# EAGLE design 16ChFNIRS (EAGLE 9.6.2)
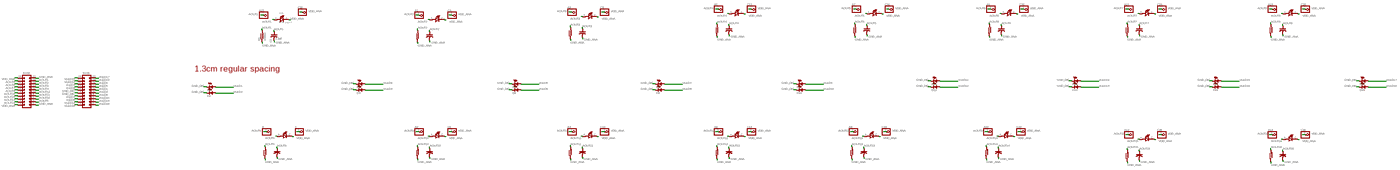
[diagram p0: schematic, sheet 1, overview]
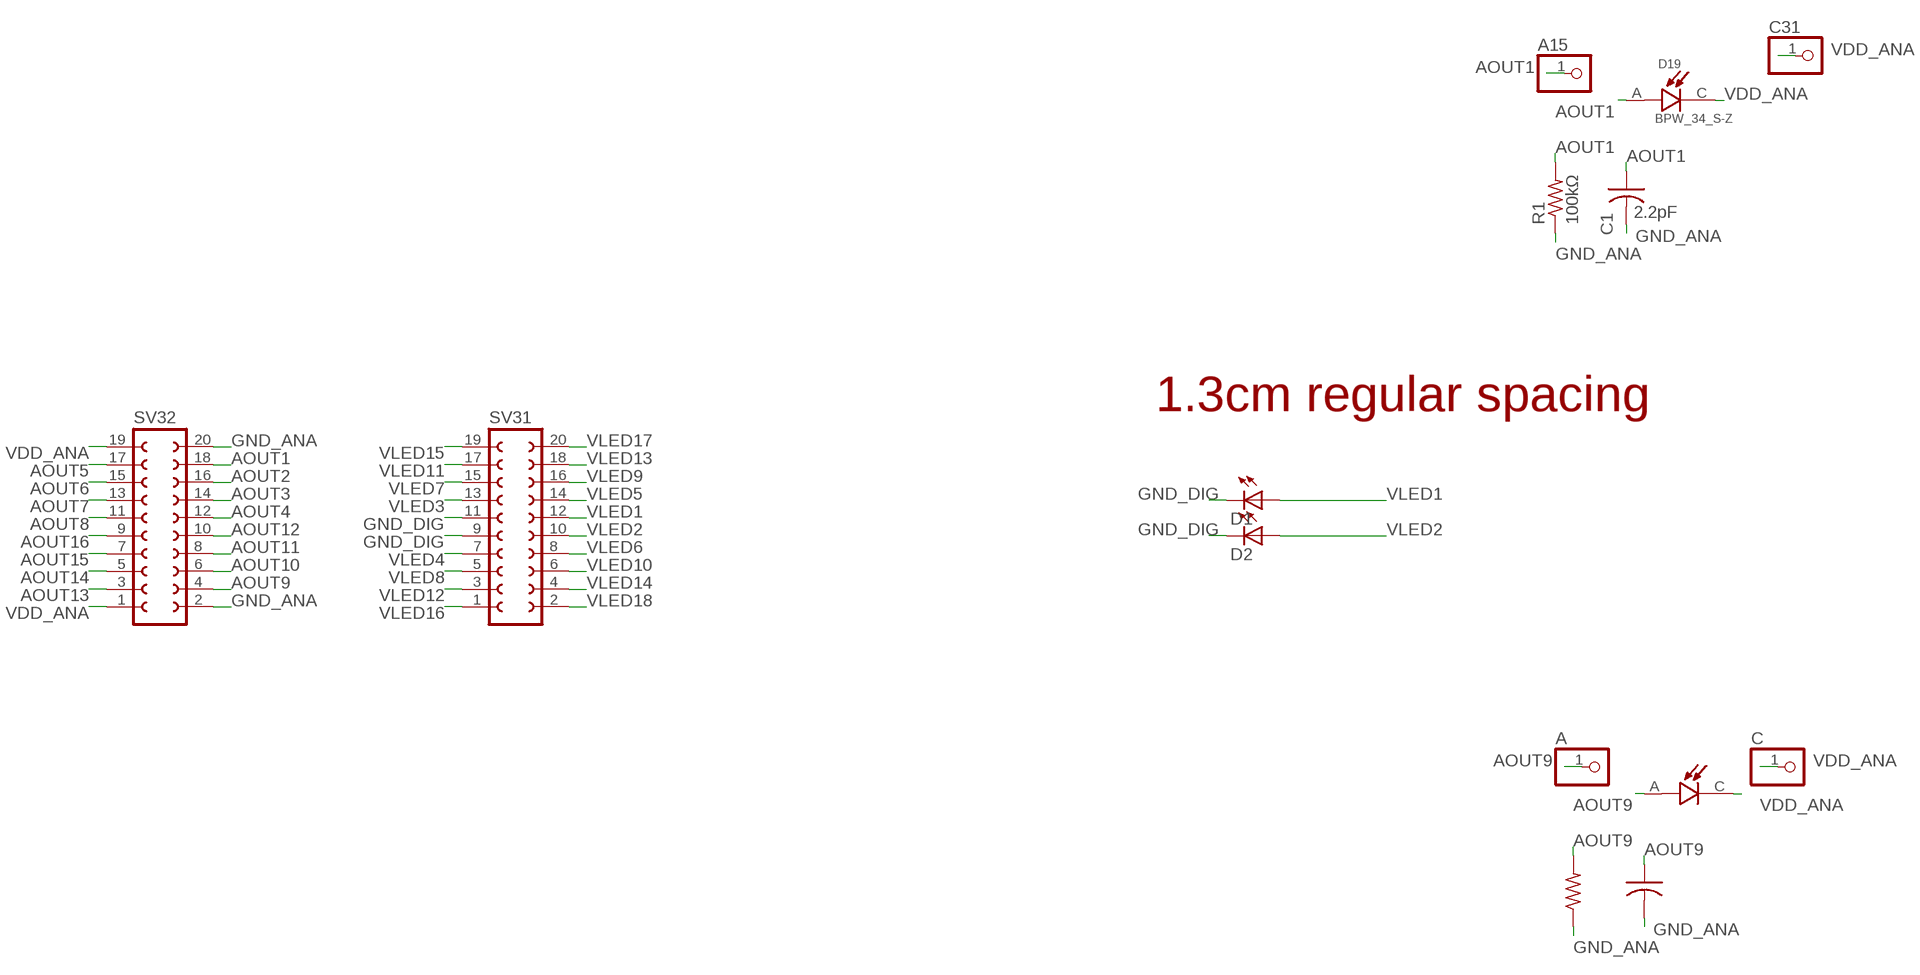
[diagram p1: schematic, sheet 1, part 1 of 4]
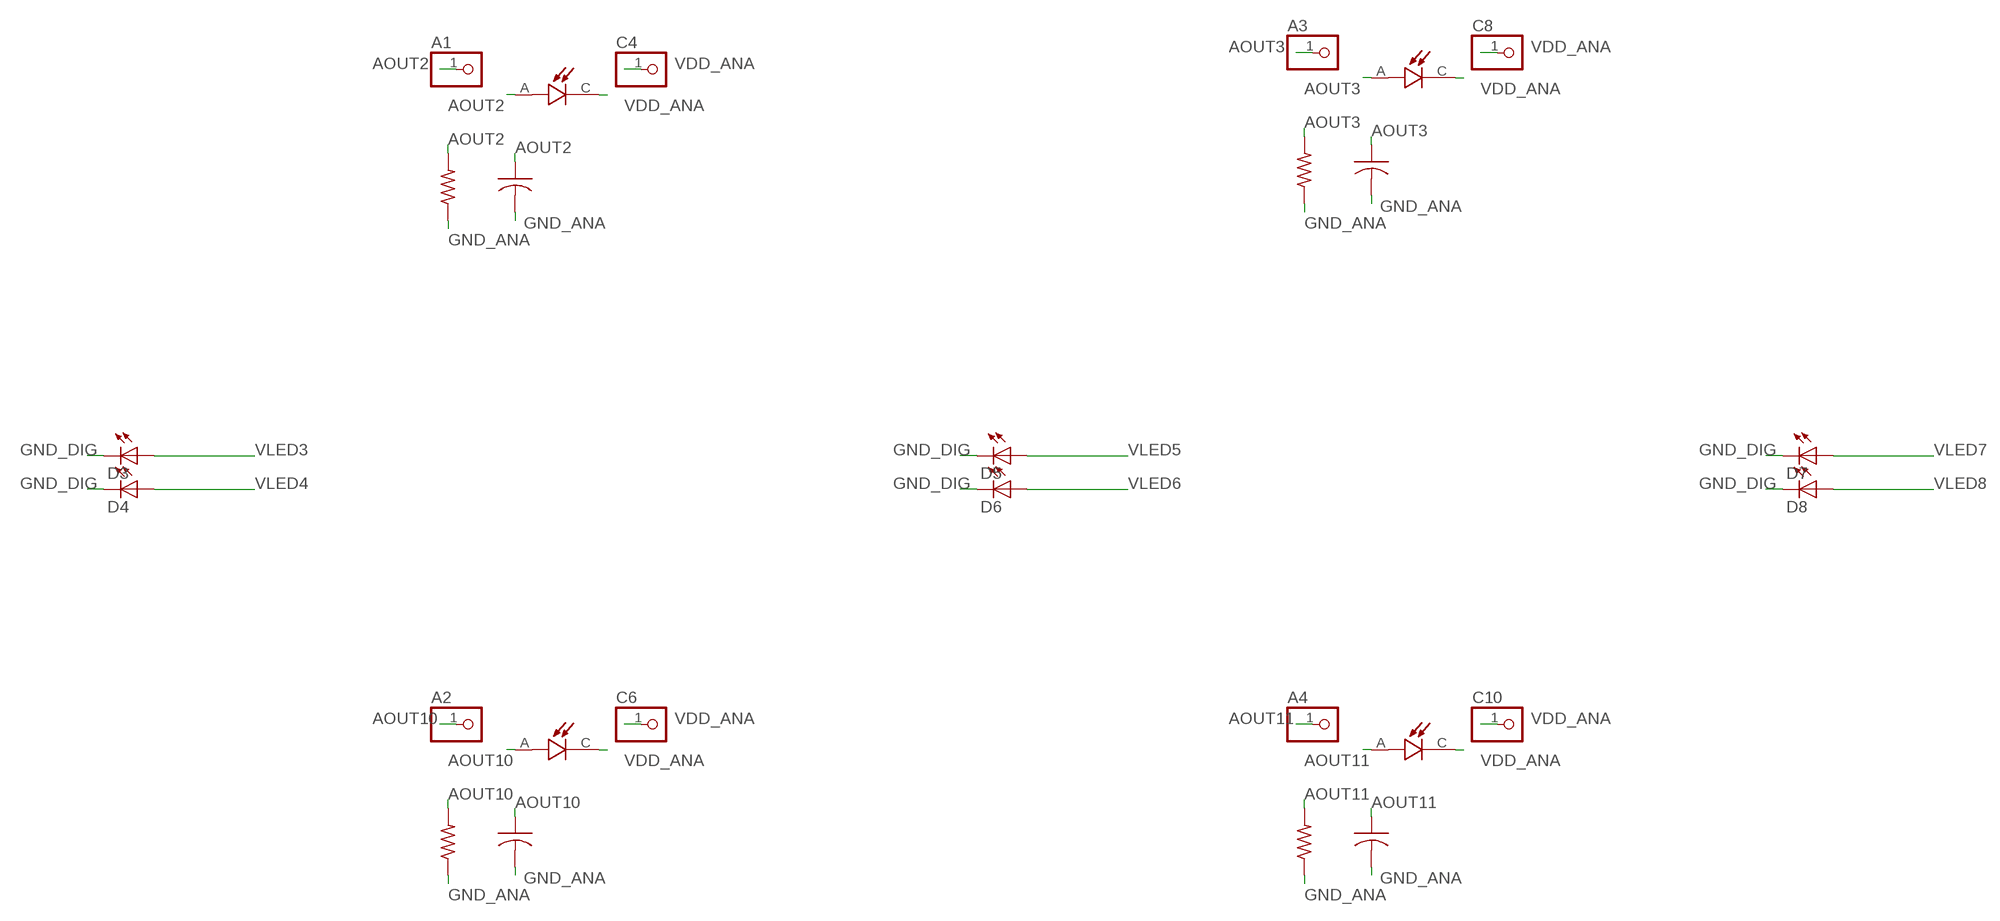
[diagram p2: schematic, sheet 1, part 2 of 4]
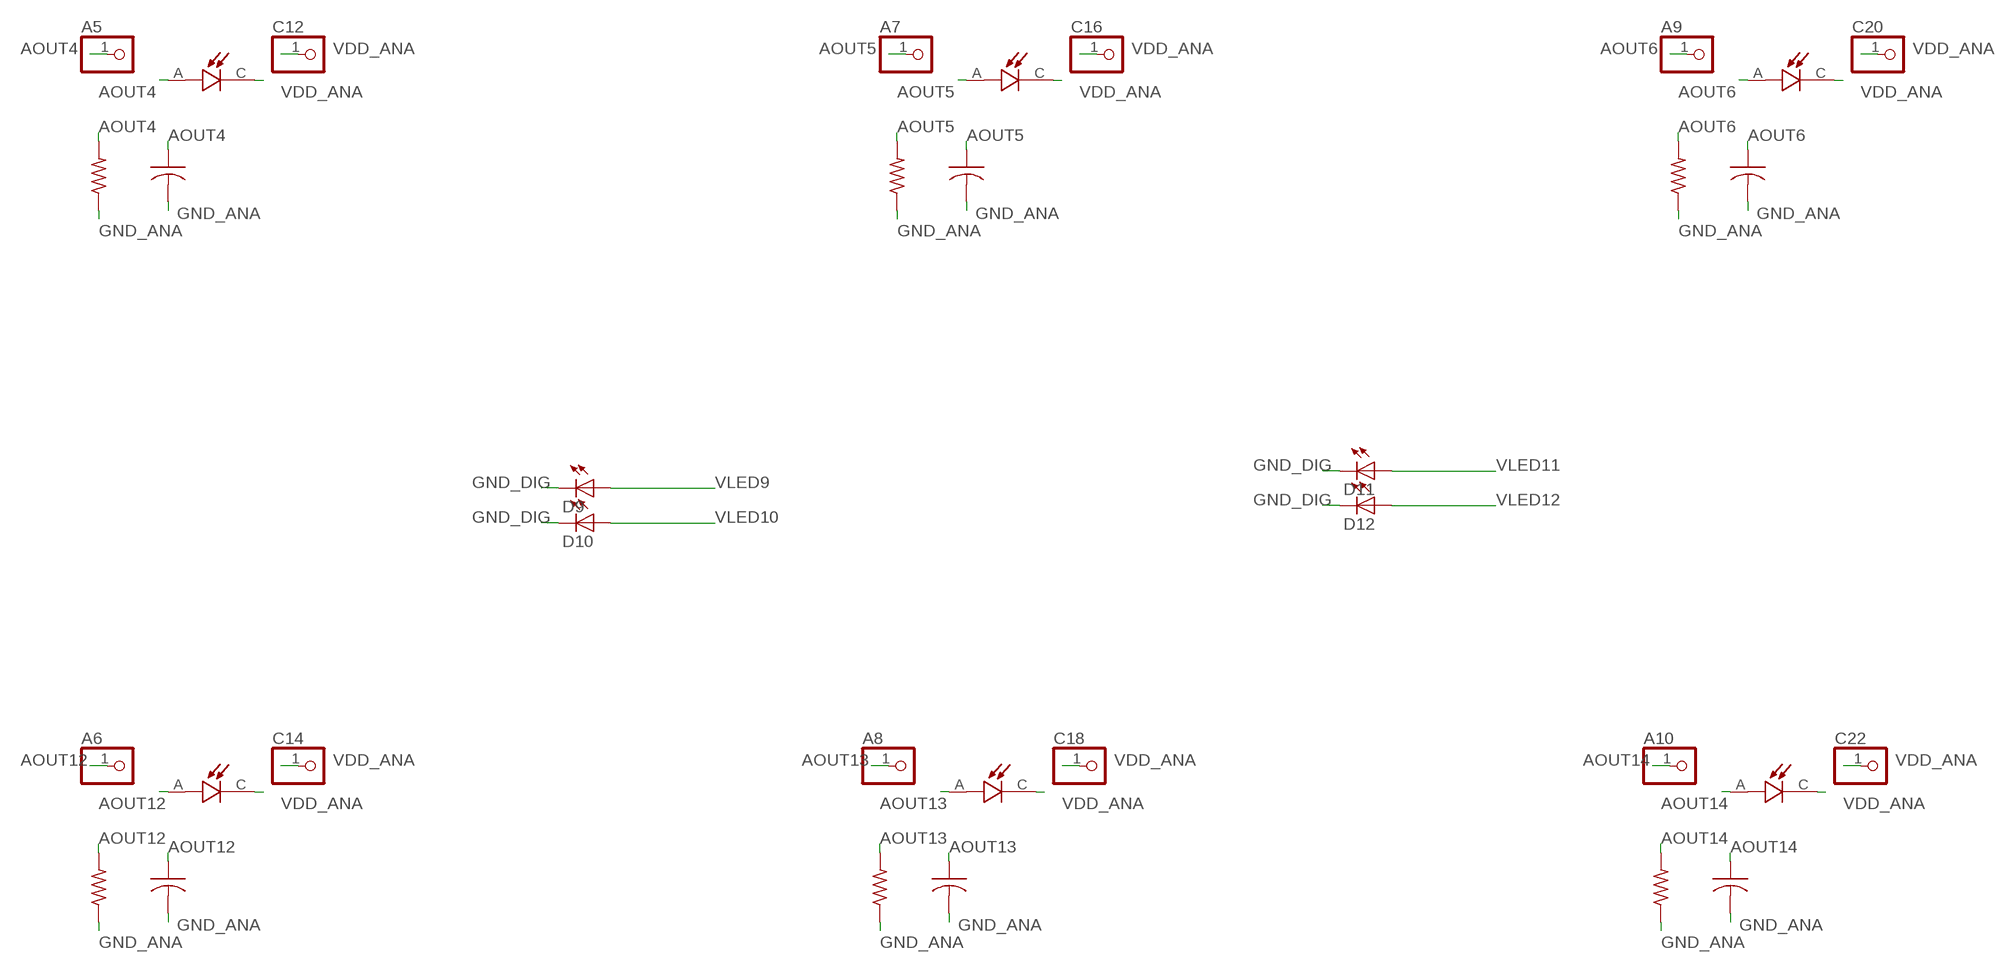
[diagram p3: schematic, sheet 1, part 3 of 4]
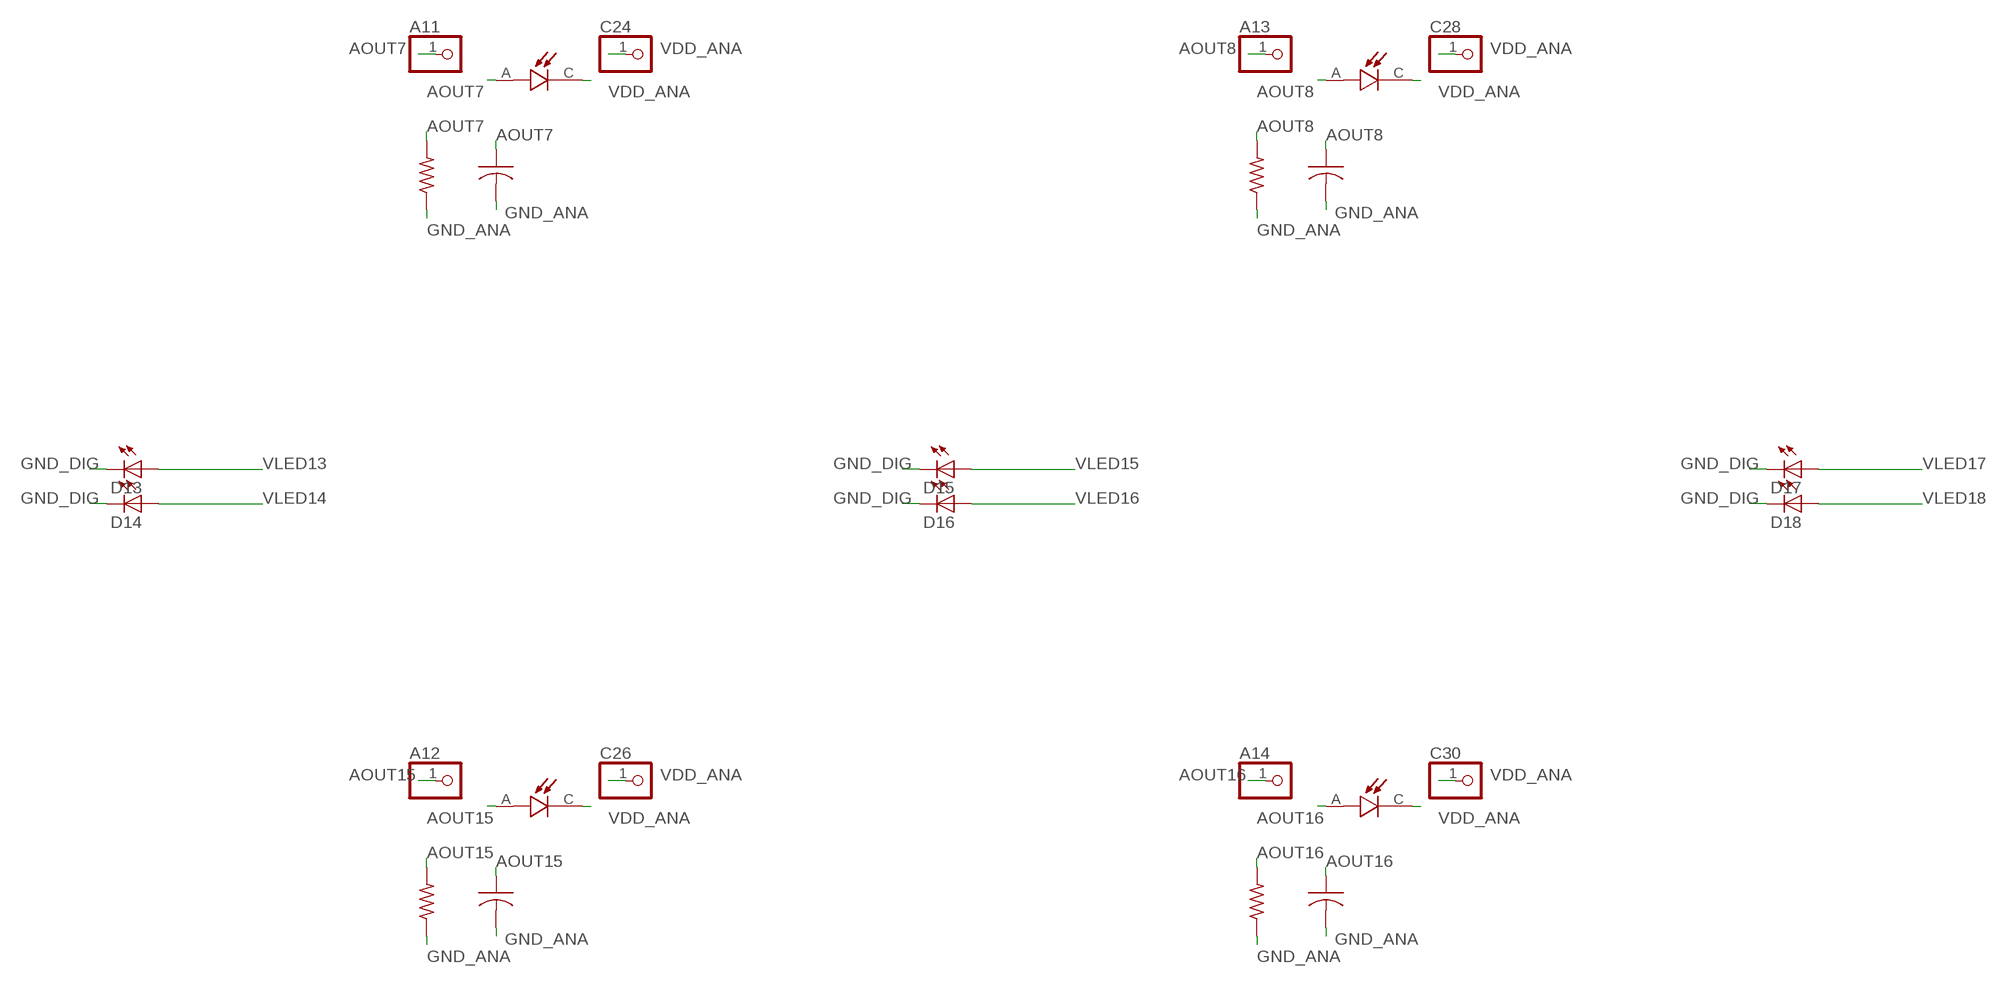
[diagram p4: schematic, sheet 1, part 4 of 4]

## Parts
A  PINHD-1X1  [1X01]
A1  PINHD-1X1  [1X01]
A2  PINHD-1X1  [1X01]
A3  PINHD-1X1  [1X01]
A4  PINHD-1X1  [1X01]
A5  PINHD-1X1  [1X01]
A6  PINHD-1X1  [1X01]
A7  PINHD-1X1  [1X01]
A8  PINHD-1X1  [1X01]
A9  PINHD-1X1  [1X01]
A10  PINHD-1X1  [1X01]
A11  PINHD-1X1  [1X01]
A12  PINHD-1X1  [1X01]
A13  PINHD-1X1  [1X01]
A14  PINHD-1X1  [1X01]
A15  PINHD-1X1  [1X01]
C  PINHD-1X1  [1X01]
C1  2.2pF  C-US025-024X044  [C025-024X044]
C2  2.2pF  C-US025-024X044  [C025-024X044]
C3  2.2pF  C-US025-024X044  [C025-024X044]
C4  PINHD-1X1  [1X01]
C5  2.2pF  C-US025-024X044  [C025-024X044]
C6  PINHD-1X1  [1X01]
C7  2.2pF  C-US025-024X044  [C025-024X044]
C8  PINHD-1X1  [1X01]
C9  2.2pF  C-US025-024X044  [C025-024X044]
C10  PINHD-1X1  [1X01]
C11  2.2pF  C-US025-024X044  [C025-024X044]
C12  PINHD-1X1  [1X01]
C13  2.2pF  C-US025-024X044  [C025-024X044]
C14  PINHD-1X1  [1X01]
C15  2.2pF  C-US025-024X044  [C025-024X044]
C16  PINHD-1X1  [1X01]
C17  2.2pF  C-US025-024X044  [C025-024X044]
C18  PINHD-1X1  [1X01]
C19  2.2pF  C-US025-024X044  [C025-024X044]
C20  PINHD-1X1  [1X01]
C21  2.2pF  C-US025-024X044  [C025-024X044]
C22  PINHD-1X1  [1X01]
C23  2.2pF  C-US025-024X044  [C025-024X044]
C24  PINHD-1X1  [1X01]
C25  2.2pF  C-US025-024X044  [C025-024X044]
C26  PINHD-1X1  [1X01]
C27  2.2pF  C-US025-024X044  [C025-024X044]
C28  PINHD-1X1  [1X01]
C29  2.2pF  C-US025-024X044  [C025-024X044]
C30  PINHD-1X1  [1X01]
C31  PINHD-1X1  [1X01]
D1  LED1206  [LED-1206]
D2  LED1206  [LED-1206]
D3  LED1206  [LED-1206]
D4  LED1206  [LED-1206]
D5  LED1206  [LED-1206]
D6  LED1206  [LED-1206]
D7  LED1206  [LED-1206]
D8  LED1206  [LED-1206]
D9  LED1206  [LED-1206]
D10  LED1206  [LED-1206]
D11  LED1206  [LED-1206]
D12  LED1206  [LED-1206]
D13  LED1206  [LED-1206]
D14  LED1206  [LED-1206]
D15  LED1206  [LED-1206]
D16  LED1206  [LED-1206]
D17  LED1206  [LED-1206]
D18  LED1206  [LED-1206]
D19  BPW_34_S-Z  [DIO_BPW_34_S-Z]
D20  BPW_34_S-Z  [DIO_BPW_34_S-Z]
D21  BPW_34_S-Z  [DIO_BPW_34_S-Z]
D22  BPW_34_S-Z  [DIO_BPW_34_S-Z]
D23  BPW_34_S-Z  [DIO_BPW_34_S-Z]
D24  BPW_34_S-Z  [DIO_BPW_34_S-Z]
D25  BPW_34_S-Z  [DIO_BPW_34_S-Z]
D26  BPW_34_S-Z  [DIO_BPW_34_S-Z]
D27  BPW_34_S-Z  [DIO_BPW_34_S-Z]
D28  BPW_34_S-Z  [DIO_BPW_34_S-Z]
D29  BPW_34_S-Z  [DIO_BPW_34_S-Z]
D30  BPW_34_S-Z  [DIO_BPW_34_S-Z]
D31  BPW_34_S-Z  [DIO_BPW_34_S-Z]
D32  BPW_34_S-Z  [DIO_BPW_34_S-Z]
D33  BPW_34_S-Z  [DIO_BPW_34_S-Z]
D34  BPW_34_S-Z  [DIO_BPW_34_S-Z]
R1  100kΩ  R-US_0204/5  [0204/5]
R2  100kΩ  R-US_0204/5  [0204/5]
R3  100kΩ  R-US_0204/5  [0204/5]
R4  100kΩ  R-US_0204/5  [0204/5]
R5  100kΩ  R-US_0204/5  [0204/5]
R6  100kΩ  R-US_0204/5  [0204/5]
R7  100kΩ  R-US_0204/5  [0204/5]
R8  100kΩ  R-US_0204/5  [0204/5]
R9  100kΩ  R-US_0204/5  [0204/5]
R10  100kΩ  R-US_0204/5  [0204/5]
R11  100kΩ  R-US_0204/5  [0204/5]
R12  100kΩ  R-US_0204/5  [0204/5]
R13  100kΩ  R-US_0204/5  [0204/5]
R14  100kΩ  R-US_0204/5  [0204/5]
R15  100kΩ  R-US_0204/5  [0204/5]
R16  100kΩ  R-US_0204/5  [0204/5]
SV31  FE10-2  [FE10-2]
SV32  FE10-2  [FE10-2]

## Nets
AOUT1: A15.1 C1.1 D19.A R1.2 SV32.18
AOUT2: A1.1 C3.1 D21.A R3.2 SV32.16
AOUT3: A3.1 C7.1 D23.A R5.2 SV32.14
AOUT4: A5.1 C11.1 D25.A R7.2 SV32.12
AOUT5: A7.1 C15.1 D27.A R9.2 SV32.17
AOUT6: A9.1 C19.1 D29.A R11.2 SV32.15
AOUT7: A11.1 C23.1 D31.A R13.2 SV32.13
AOUT8: A13.1 C27.1 D33.A R15.2 SV32.11
AOUT9: A.1 C2.1 D20.A R2.2 SV32.4
AOUT10: A2.1 C5.1 D22.A R4.2 SV32.6
AOUT11: A4.1 C9.1 D24.A R6.2 SV32.8
AOUT12: A6.1 C13.1 D26.A R8.2 SV32.10
AOUT13: A8.1 C17.1 D28.A R10.2 SV32.3
AOUT14: A10.1 C21.1 D30.A R12.2 SV32.5
AOUT15: A12.1 C25.1 D32.A R14.2 SV32.7
AOUT16: A14.1 C29.1 D34.A R16.2 SV32.9
GND_ANA: C1.2 C2.2 C3.2 C5.2 C7.2 C9.2 C11.2 C13.2 C15.2 C17.2 C19.2 C21.2 C23.2 C25.2 C27.2 C29.2 R1.1 R2.1 R3.1 R4.1 R5.1 R6.1 R7.1 R8.1 R9.1 R10.1 R11.1 R12.1 R13.1 R14.1 R15.1 R16.1 SV32.2 SV32.20
GND_DIG: D1.C D2.C D3.C D4.C D5.C D6.C D7.C D8.C D9.C D10.C D11.C D12.C D13.C D14.C D15.C D16.C D17.C D18.C SV31.9 SV31.11
VDD_ANA: C4.1 C6.1 C8.1 C10.1 C12.1 C14.1 C16.1 C18.1 C20.1 C22.1 C24.1 C26.1 C28.1 C30.1 C31.1 C.1 D19.C D20.C D21.C D22.C D23.C D24.C D25.C D26.C D27.C D28.C D29.C D30.C D31.C D32.C D33.C D34.C SV32.1 SV32.19
VLED1: D1.A SV31.12
VLED2: D2.A SV31.10
VLED3: D3.A SV31.13
VLED4: D4.A SV31.7
VLED5: D5.A SV31.14
VLED6: D6.A SV31.8
VLED7: D7.A SV31.15
VLED8: D8.A SV31.5
VLED9: D9.A SV31.16
VLED10: D10.A SV31.6
VLED11: D11.A SV31.17
VLED12: D12.A SV31.3
VLED13: D13.A SV31.18
VLED14: D14.A SV31.4
VLED15: D15.A SV31.19
VLED16: D16.A SV31.1
VLED17: D17.A SV31.20
VLED18: D18.A SV31.2

## Notes on the sheet
- 1.3cm regular spacing

## Library data of the parts
A A1-A15 C C4 C6 C8 C10 C12 C14 C16 C18 C20 C22 C24 C26 C28 C30 C31 = adafruit:PINHD-1X1: Pin header 1x1 for 0.1" spacing With round pins
C1-C3 C5 C7 C9 C11 C13 C15 C17 C19 C21 C23 C25 C27 C29 = adafruit:C-US: CAPACITOR, American symbol
D1-D18 = epic:LED: LEDs Standard schematic elements and footprints for 5mm, 3mm, 1206, and 0603 sized LEDs. 5mm - Spark Fun Electronics SKU : COM-00529 (and others)
D19-D34 = BPW_34_S-Z:BPW_34_S-Z: Silicon PIN Photodiode Check availability <https://pricing.snapeda.com/parts/BPW%2034%20S-Z/OSRAM%20Opto/view-part?ref=eda>; AVAILABILITY: In Stock; DESCRIPTION: Photodiode 850nm 20ns 120° 2-SMD, Gull Wing; MF: OSRAM Opto; MP: BPW 34 S-Z; PACKAGE: SMD-2 OSRAM Opto Semiconductors; PRICE: None; PURCHASE-URL: https://pricing.snapeda.com/search/part/BPW 34 S-Z/?ref=eda
R1-R16 = adafruit:R-US_: RESISTOR, American symbol
SV31 SV32 = con-lsta:FE10-2: FEMALE HEADER; OC_FARNELL: unknown; OC_NEWARK: unknown

## Board
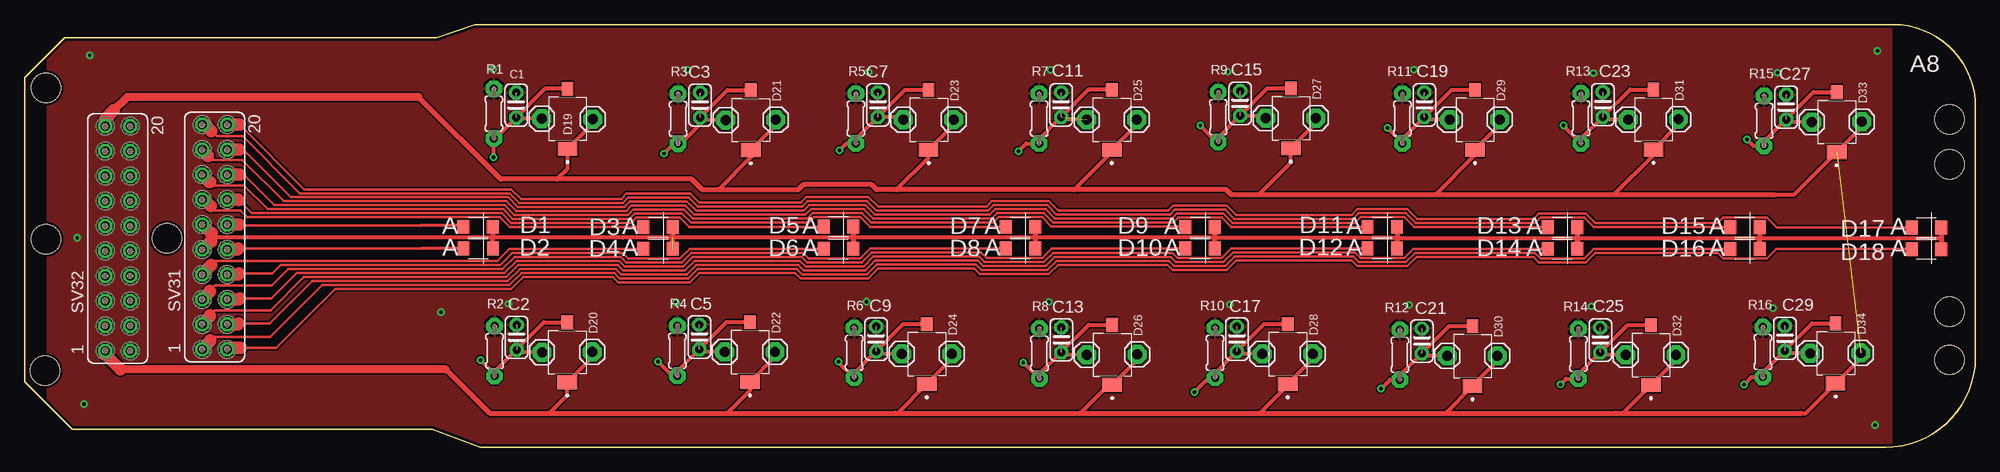
[diagram p5: board, top side]
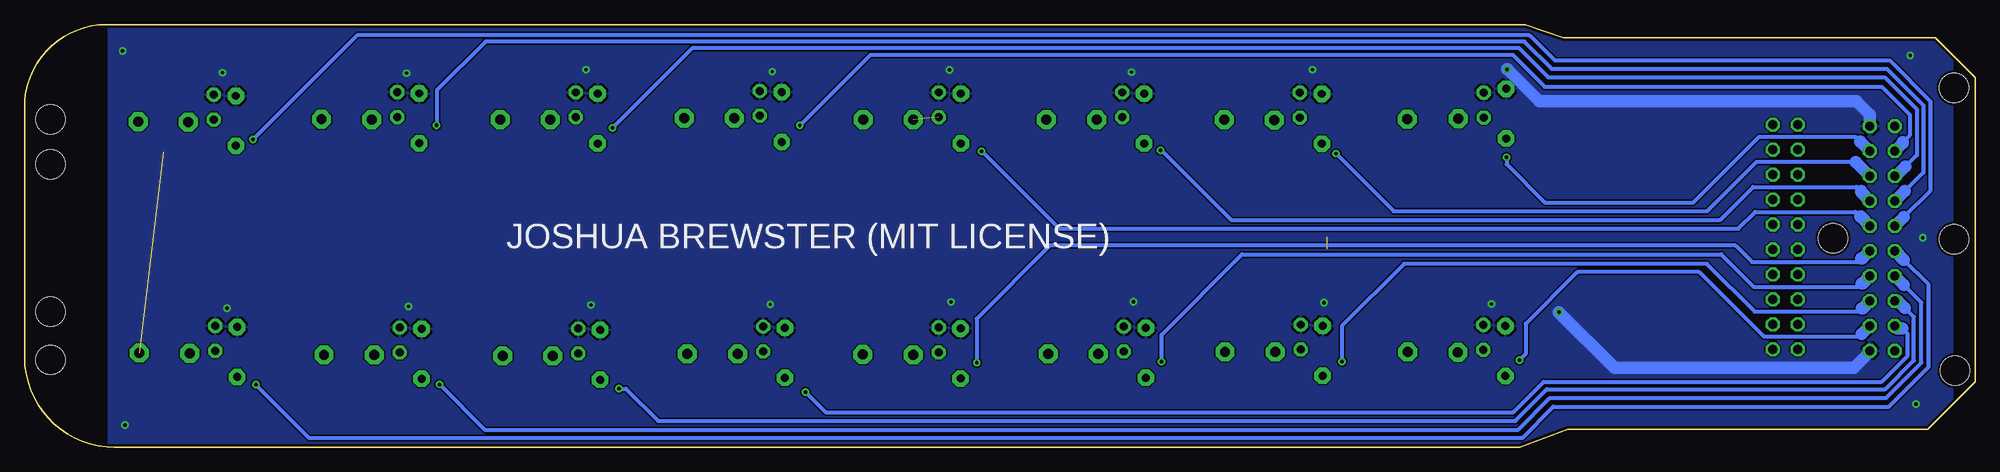
[diagram p6: board, bottom side, seen from below]

Size 198.42 x 43.03 mm. Coordinates in mm from the lower left corner, seen from the top.
Outline: 41.91,41.71 4.06,41.71 0,37.64 0,6.65 4.83,1.83 41.45,1.83 46.33,0 189.28,0 arc90 198.43,9.14 198.43,34.65 arc90 190.04,43.03 45.77,43.03 41.91,41.71
Copper layers (1*16): Top 0.035mm / dielectric 1.5mm / Bottom 0.035mm
Design rules "default *": minimum track width 6mil, minimum drill 0.35mm, track to track 6mil, track to pad 6mil, pad to pad 6mil, via to via 6mil, smd to smd 6mil, copper to edge 10mil, drill to drill 6mil, minimum pad ring 10mil, minimum via ring 8mil, stop-mask expansion 4mil, vias tented up to drill 0mil, thermal gap 10mil
Holes 3 mm at 2.17,36.58 14.47,21.28 2.17,21.18 2.07,7.78 195.77,33.38 195.77,28.78 195.77,13.78 195.77,8.88

### Footprints (pad centres in the part's own frame; a part is rotated, then mirrored left to right if it is on the bottom)
1X01 = drill 1.016 pad 1.93 octagon: 1 0,0
C025-024X044 = drill 0.813 pad 1.422 octagon: 1 -1.27,0; 2 1.27,0
LED-1206 = smd 1.2 x 1.4: A -1.5,0; C 1.5,0
DIO_BPW_34_S-Z = smd 1.4 x 1.2: A -3.05,0 | smd 1.4 x 2: C 3.05,0
0204/5 = drill 0.813 pad 1.676 octagon: 1 -2.54,0; 2 2.54,0
FE10-2 = drill 0.914 octagon: 1 -11.43,1.27; 2 -11.43,-1.27; 3 -8.89,1.27; 4 -8.89,-1.27; 5 -6.35,1.27; 6 -6.35,-1.27; 7 -3.81,1.27; 8 -3.81,-1.27; 9 -1.27,1.27; 10 -1.27,-1.27; 11 1.27,1.27; 12 1.27,-1.27; 13 3.81,1.27; 14 3.81,-1.27; 15 6.35,1.27; 16 6.35,-1.27; 17 8.89,1.27; 18 8.89,-1.27; 19 11.43,1.27; 20 11.43,-1.27

### Placement (x,y rotation side)
A  52.63,9.65 0 top
A1  71.3,33.3 0 top
A2  71.22,9.68 0 top
A3  89.38,33.32 0 top
A4  89.2,9.47 0 top
A5  108.03,33.32 0 top
A6  108.05,9.4 0 top
A7  126.24,33.48 0 top
A8  125.91,9.47 0 top
A9  144.96,33.32 0 top
A10  144.7,9.27 0 top
A11  163.12,33.35 0 top
A12  162.86,9.37 0 top
A13  181.76,33.1 0 top
A14  181.64,9.55 0 top
A15  52.6,33.43 0 top
C  57.73,9.68 0 top
C1  50.01,34.82 90 top
C2  50.04,11.18 90 top
C3  68.71,34.82 90 top
C4  76.4,33.32 0 top
C5  68.63,11.2 90 top
C6  76.33,9.7 0 top
C7  86.79,34.85 90 top
C8  94.49,33.35 0 top
C9  86.61,11 90 top
C10  94.31,9.5 0 top
C11  105.44,34.85 90 top
C12  113.13,33.35 0 top
C13  105.46,10.92 90 top
C14  113.16,9.42 0 top
C15  123.65,35 90 top
C16  131.34,33.5 0 top
C17  123.32,11 90 top
C18  131.01,9.5 0 top
C19  142.37,34.85 90 top
C20  150.06,33.35 0 top
C21  142.11,10.79 90 top
C22  149.81,9.3 0 top
C23  160.53,34.87 90 top
C24  168.22,33.38 0 top
C25  160.27,10.9 90 top
C26  167.97,9.4 0 top
C27  179.17,34.62 90 top
C28  186.87,33.12 0 top
C29  179.04,11.07 90 top
C30  186.74,9.58 0 top
C31  57.78,33.38 0 top
D1  46.13,22.43 0 top
D2  46.15,20.22 0 top
D3  64.44,22.4 0 top
D4  64.44,20.19 0 top
D5  82.78,22.45 0 top
D6  82.78,20.19 0 top
D7  101.3,22.43 0 top
D8  101.3,20.22 0 top
D9  119.56,22.4 0 top
D10  119.56,20.22 0 top
D11  138.1,22.43 0 top
D12  138.1,20.22 0 top
D13  156.41,22.4 0 top
D14  156.41,20.19 0 top
D15  174.98,22.4 0 top
D16  174.98,20.17 0 top
D17  193.44,22.37 0 top
D18  193.44,20.16 0 top
D19  55.22,33.43 270 top
D20  55.19,9.65 270 top
D21  73.86,33.3 270 top
D22  73.79,9.68 270 top
D23  91.95,33.32 270 top
D24  91.77,9.47 270 top
D25  110.59,33.32 270 top
D26  110.62,9.4 270 top
D27  128.8,33.48 270 top
D28  128.47,9.47 270 top
D29  147.52,33.32 270 top
D30  147.27,9.27 270 top
D31  165.68,33.35 270 top
D32  165.43,9.37 270 top
D33  184.33,33.1 270 top
D34  184.2,9.55 270 top
R1  47.72,33.96 270 top
R2  47.8,9.78 270 top
R3  66.47,33.43 270 top
R4  66.4,9.8 270 top
R5  84.56,33.45 270 top
R6  84.38,9.6 270 top
R7  103.2,33.45 270 top
R8  103.23,9.53 270 top
R9  121.41,33.6 270 top
R10  121.08,9.6 270 top
R11  140.13,33.45 270 top
R12  139.88,9.4 270 top
R13  158.29,33.48 270 top
R14  158.04,9.5 270 top
R15  176.94,33.22 270 top
R16  176.81,9.68 270 top
SV31  19.32,21.39 90 top
SV32  9.46,21.24 90 top

### Tracks (layer width: path | path; a pad name or v marks a point on that pad's centre or on a via)
AOUT1  (via drill 0.35)
  Top 0.254: D19.A 55.16,36.54
  Top 0.406: D19.A 52.93,36.48 C1.1 | v47.68,29.52 47.68,31.38 R1.2 47.87,31.42 C1.1 | A15.1 50.14,33.43 C1.1
  Bottom 0.406: v47.68,29.52 47.68,28.81 43.78,24.91 28.68,24.91 21.99,31.6 12.21,31.6 11.73,31.12
  Bottom 1.27: SV32.18 11.72,31.12 11.73,31.12
AOUT2  (via drill 0.35)
  Top 0.406: 68.71,33.58 71.48,36.35 D21.A | C3.1 68.71,33.58 | C3.1 68.68,33.55 68.94,33.3 A1.1 | C3.1 68.71,32.87 66.73,30.89 R3.2 66.02,30.89 v65.02,29.89 | 68.99,33.3 68.71,33.58
  Bottom 0.406: v65.02,29.89 59.16,24.03 27.29,24.03 22.27,29.05 12.19,29.05
  Bottom 1.27: SV32.16 12.19,29.04 12.19,29.05
AOUT3  (via drill 0.35)
  Top 0.406: 86.79,33.61 89.56,36.37 D23.A | C7.1 86.79,33.61 | C7.1 86.77,33.58 84.56,31.37 R5.2 83.58,30.91 v82.88,30.21 | 87.07,33.32 86.79,33.61 | A3.1 89.13,33.58 C7.1
  Bottom 0.406: v82.88,30.21 82.78,30.21 75.7,23.13 25.97,23.13 22.6,26.5 12.08,26.5 11.64,26.06
  Bottom 1.27: SV32.14 11.64,25.95 11.64,26.06
AOUT4  (via drill 0.35)  (1 unrouted)
  Top 0.406: D25.A 108.2,36.37 105.44,33.61 105.72,33.32 A5.1 | C11.1 105.41,33.58 103.2,31.37 R7.2 101.86,30.91 v101.09,30.14
  Bottom 0.406: v101.09,30.14 93.19,22.24 24.12,22.24 22.4,23.96 12.2,23.96 11.7,23.46
  Bottom 1.27: SV32.12 11.68,23.46 11.7,23.46
AOUT5  (via drill 0.35)
  Top 0.406: 123.65,33.76 126.42,36.53 D27.A | C15.1 123.65,33.76 | C15.1 123.62,33.73 121.41,31.52 R9.2 121.26,31.06 v119.58,32.74 | 123.93,33.48 123.65,33.76 | C15.1 125.98,33.73 A7.1
  Bottom 0.406: v119.58,32.74 112.37,39.95 47.07,39.95 43.82,36.7 9.55,36.7 6.7,33.86 6.7,31.73 7.37,31.07
  Bottom 1.27: SV32.17 7.37,30.95 7.37,31.07
AOUT6  (via drill 0.35)
  Top 0.406: 142.37,33.61 145.14,36.37 D29.A | 142.37,33.61 C19.1 142.34,33.58 140.13,31.37 R11.2 140.13,30.99 v138.61,32.51 | 142.37,33.61 142.65,33.32 A9.1
  Bottom 0.406: v138.61,32.51 130.46,40.66 46.47,40.66 43.47,37.66 9.22,37.66 5.97,34.4 5.97,29.72 7.13,28.55
  Bottom 1.27: 7.13,28.55 8.1,27.59 SV32.15
AOUT7  (via drill 0.35)
  Top 0.254: 156.54,32.72 v156.51,32.75
  Top 0.406: 160.53,33.63 163.3,36.4 D31.A | 160.53,33.63 C23.1 160.5,33.6 158.29,31.39 R13.2 156.51,32.71 v156.51,32.75 | 160.53,33.63 160.81,33.35 A11.1
  Bottom 0.406: 7.19,26.06 5.29,27.95 5.29,34.82 9.01,38.53 43.11,38.53 45.87,41.3 151.54,41.3 156.49,36.35 156.49,32.75 v156.51,32.75
  Bottom 1.27: 7.19,26.06 8.19,25.06 SV32.13
AOUT8  (via drill 0.35)
  Top 0.406: 179.15,33.35 C27.1 179.17,33.38 181.94,36.15 D33.A | 179.15,33.35 176.94,31.14 R15.2 175.83,30.68 v175.19,31.33 | A13.1 179.4,33.1 179.15,33.35
  Bottom 0.406: 7.27,23.42 4.6,26.1 4.6,35.25 8.73,39.38 42.79,39.38 45.34,41.94 164.6,41.94 175.19,31.35 v175.19,31.33
  Bottom 1.27: 7.27,23.42 SV32.11
AOUT9  (via drill 0.35)
  Top 0.406: 50.04,9.93 52.81,12.7 D20.A | 50.04,9.93 C2.1 50.01,9.91 47.8,7.7 R2.2 47.8,7.43 v46.36,8.87 | 50.04,9.93 50.32,9.65 A.1
  Bottom 0.406: 11.58,11.54 11.87,11.25 21.53,11.25 28.11,17.84 40.48,17.84 45.75,12.57 45.75,9.48 v46.36,8.87
  Bottom 1.27: SV32.4 11.54,11.54 11.58,11.54
AOUT10  (via drill 0.35)
  Top 0.406: 68.63,9.96 71.4,12.73 D22.A | 68.63,9.96 C5.1 68.61,9.93 66.4,7.72 R4.2 65.88,7.26 64.44,8.7 v64.44,8.72 | 68.63,9.96 68.91,9.68 A2.1
  Bottom 0.406: 11.56,14.14 11.91,13.79 22.45,13.79 27.33,18.67 58.11,18.67 64.44,12.34 v64.44,8.72
  Bottom 1.27: SV32.6 11.48,14.14 11.56,14.14
AOUT11  (via drill 0.35)
  Top 0.406: 86.61,9.76 89.38,12.52 D24.A | 86.61,9.76 C9.1 86.59,9.73 84.38,7.52 R6.2 82.78,8.66 v82.78,8.7 | 86.61,9.76 86.9,9.47 A4.1
  Bottom 0.406: 11.54,16.68 11.9,16.32 22.55,16.32 25.85,19.62 74.62,19.62 82.78,11.45 v82.78,8.7
  Bottom 1.27: SV32.8 11.48,16.68 11.54,16.68
AOUT12  (via drill 0.35)
  Top 0.406: 105.46,9.68 108.23,12.45 D26.A | 105.46,9.68 C13.1 105.44,9.65 103.23,7.44 R8.2 v101.59,8.62 v101.58,8.62 | 105.46,9.68 105.74,9.4 A6.1
  Bottom 0.406: 11.63,19.18 11.97,18.85 22.72,18.85 24.39,20.52 94.13,20.52 101.58,13.08 v101.58,8.62
  Bottom 1.27: SV32.10 11.52,19.18 11.63,19.18
AOUT13  (via drill 0.35)
  Top 0.406: 123.32,9.76 126.09,12.52 D28.A | 123.32,9.76 C17.1 123.29,9.73 121.08,7.52 R10.2 120.44,7.06 v119,5.62 | 123.32,9.76 123.6,9.47 A8.1
  Bottom 0.406: 7.44,12.09 6.89,11.53 6.89,9.3 9.53,6.66 43.93,6.66 47.03,3.55 116.93,3.55 v119,5.62
  Bottom 1.27: SV32.3 7.93,12.09 7.44,12.09
AOUT14  (via drill 0.35)
  Top 0.406: 142.11,9.55 144.88,12.32 D30.A | 142.11,9.55 C21.1 142.09,9.52 139.88,7.31 R12.2 138.88,6.86 v137.98,5.95 | 142.11,9.55 142.39,9.27 A10.1
  Bottom 0.406: 7.17,14.18 6.26,13.27 6.26,8.81 9.19,5.89 43.59,5.89 46.8,2.68 133.99,2.68 137.27,5.95 v137.98,5.95
  Bottom 1.27: 7.17,14.18 7.88,14.89 SV32.5
AOUT15  (via drill 0.35)
  Top 0.406: 160.27,9.65 163.04,12.42 D32.A | 160.27,9.65 C25.1 160.25,9.63 158.04,7.42 R14.2 156.79,6.96 v156.22,6.39 | 160.27,9.65 160.56,9.37 A12.1
  Bottom 0.406: 7.27,16.49 5.49,14.72 5.49,8.59 9.08,5 43.29,5 46.5,1.79 151.61,1.79 v156.22,6.39
  Bottom 1.27: 7.27,16.49 SV32.7
AOUT16  (via drill 0.35)
  Top 0.406: 179.05,9.83 181.81,12.6 D34.A | 179.05,9.83 C29.1 179.02,9.8 176.81,7.59 R16.2 175.66,7.14 v174.89,6.36 | 179.05,9.83 179.33,9.55 A14.1
  Bottom 0.406: 7.29,19.08 4.77,16.56 4.77,8.16 8.82,4.11 42.92,4.11 46.06,0.97 169.54,0.97 174.89,6.32 v174.89,6.36
  Bottom 1.27: 7.29,19.08 8.18,19.97 SV32.9
GND_ANA  (via drill 0.35)
  Bottom 1.27: SV32.20 10.73,33.85 12.12,35.23 44.38,35.23 v47.62,38.48 | SV32.2 10.73,9.71 12.38,8.06 36.69,8.06 v42.37,13.74
  other vias: 5.36,21.31 188.44,40.34 178.31,38.13 159.56,38.07 141.33,38.43 122.38,38.23 104.34,38.4 85.85,38.18 67.44,38.43 66.27,14.71 85.65,14.81 104.22,14.78 122.58,14.53 140.82,14.48 159.36,14.33 177.83,14.15 188.19,2.24 6.63,39.88 6.05,4.37 49.2,14.58
  pour Bottom: 2.29,1.57 2.29,41.71 41.91,41.71 41.91,45.77 189.89,45.77 189.89,-3.25 41.43,-3.25 41.43,1.57
  pour Top: 2.29,41.71 41.91,41.71 41.91,45.77 189.89,45.77 189.89,-3.25 41.43,-3.25 41.43,1.57 2.29,1.57
GND_DIG  (1 unrouted)
  Top 0.406: 60.85,21.35 65.94,21.35 84.25,21.35 84.28,21.37 84.31,21.35 102.8,21.35 120.95,21.35 121.06,21.24 121.1,21.29 139.6,21.29 139.63,21.25 157.91,21.25 176.46,21.25 176.48,21.23 194.95,21.23 | 60.85,21.35 60.85,21.34 | 60.85,21.35 47.63,21.35 47.62,21.35 19.45,21.35 19.45,21.36 | 19.02,21.78 19.45,21.36 | 19.45,21.36 19.03,20.94 19.01,20.94
  Top 0.508: D1.C 47.63,21.35 47.63,20.24 D2.C | D17.C 194.95,22.36 194.95,21.23 194.95,20.17 D18.C | D3.C 65.94,21.41 | D4.C 65.94,21.35 | D5.C 84.28,21.37 D6.C | D7.C 102.8,21.35 D8.C | D9.C 121.06,21.24 D10.C | D11.C 139.6,21.29 D12.C | D13.C 157.91,21.25 D14.C | D15.C 176.48,21.23 D16.C
  Top 1.27: SV31.11 18.93,21.78 19.02,21.78 | SV31.9 18.88,20.94 19.01,20.94
VDD_ANA  (1 unrouted)
  Top 0.406: 54.15,27.28 55.22,28.35 D19.C 57.78,32.94 C31.1 | C.1 57.73,9.14 D20.C 55.19,5.28 53.37,3.45 | C4.1 76.4,32.79 D21.C 73.86,29.51 70.59,26.23 | C6.1 76.33,9.17 D22.C 73.79,5.79 71.45,3.45 | C8.1 94.49,32.81 D23.C 91.95,29.48 88.67,26.21 | C10.1 94.31,8.96 D24.C 88.8,3.45 88.54,3.45 | C12.1 113.13,32.81 D25.C 110.59,30.04 106.76,26.21 | C14.1 113.16,8.89 D26.C 110.26,6.35 107.37,3.45 | C16.1 131.34,32.97 D27.C 128.8,28.96 125.55,25.7 | C18.1 131.01,8.96 D28.C 128.47,6.3 125.63,3.45 | C20.1 150.06,32.81 D29.C 147.52,29.72 143.51,25.7 | C22.1 149.81,8.76 D30.C 147.27,6.19 144.53,3.45 | C24.1 168.22,32.84 D31.C 165.68,29.74 161.65,25.7 | C26.1 167.97,8.86 D32.C 162.56,3.45 161.82,3.45 | C28.1 186.87,32.59 D33.C 179.99,25.7 177.99,25.7 | C30.1 186.74,9.04 D34.C 181.15,3.45 180.7,3.45
  Top 0.508: 42.85,7.91 47.31,3.45 53.37,3.45 71.45,3.45 88.54,3.45 107.37,3.45 125.63,3.45 144.53,3.45 161.82,3.45 180.7,3.45 | 40.06,35.64 48.42,27.28 54.15,27.28 67.86,27.28 68.9,26.23 70.59,26.23 78.7,26.23 79.19,26.72 86.16,26.72 86.68,26.21 88.67,26.21 106.76,26.21 122.25,26.21 122.75,25.7 125.55,25.7 143.51,25.7 161.65,25.7 177.99,25.7
  Top 0.813: 42.85,7.91 9.75,7.91 | 9.08,34.3 10.42,35.64 40.06,35.64
  Top 1.27: SV32.19 8.19,33.41 9.08,34.3 | SV32.1 8.19,9.47 9.75,7.91
VLED1
  Top 0.254: 40.25,22.54 21.94,22.54 21.83,22.65
  Top 0.305: D1.A 44.51,22.54 40.25,22.54
  Top 1.27: SV31.12 21.82,22.66 21.83,22.65
VLED2
  Top 0.254: 40.36,20.21 21.73,20.21 21.73,20.22
  Top 0.305: D2.A 40.36,20.21
  Top 1.27: SV31.10 21.63,20.12 21.73,20.21
VLED3
  Top 0.254: D3.A 49.36,22.39 48.34,23.41 22.63,23.41 21.93,24.1 19.33,24.1 18.94,24.5 18.94,24.55
  Top 0.305: D3.A
  Top 1.27: SV31.13 18.29,25.2 18.94,24.55
VLED4
  Top 0.254: D4.A 49.32,20.19 48.07,18.94 19.4,18.94 19.01,18.55
  Top 1.27: SV31.7 19.01,18.53 19.01,18.55
VLED5
  Top 0.254: 81.27,22.47 81.23,22.43 67.6,22.43 66.66,23.38 62.22,23.38 61.68,22.84 49.49,22.84 48.51,23.81 23.11,23.81 21.78,25.15
  Top 0.305: 81.27,22.47 D5.A
  Top 1.27: SV31.14 21.73,25.2 21.78,25.15
VLED6
  Top 0.254: 81.11,20.19 67.64,20.19 66.66,19.21 61.38,19.21 60.81,19.78 49.61,19.78 48.36,18.53 26.04,18.53 25.18,17.67 21.82,17.67
  Top 0.305: 81.11,20.19 D6.A
  Top 1.27: SV31.8 21.73,17.58 21.82,17.67
VLED7
  Top 0.254: D7.A 86,22.43 84.99,23.43 80.33,23.43 79.75,22.85 67.81,22.85 66.87,23.79 62.06,23.79 61.51,23.24 49.65,23.24 48.68,24.22 24.72,24.22 22.29,26.65 19.26,26.65 18.9,27.01
  Top 1.27: SV31.15 18.78,27.01 18.9,27.01
VLED8
  Top 0.254: D8.A 86,20.22 84.99,19.21 79.77,19.21 79.2,19.79 67.8,19.79 66.82,18.81 61.21,18.81 60.64,19.37 49.84,19.37 48.59,18.13 26.81,18.13 25.12,16.44 19.36,16.44 18.83,15.91
  Top 1.27: SV31.5 18.83,15.81 18.83,15.91
VLED9
  Top 0.254: D9.A 117.99,22.47 104.45,22.47 103.51,23.41 99.08,23.41 98.53,22.86 86.14,22.86 85.16,23.84 80.17,23.84 79.59,23.27 67.96,23.27 67.03,24.19 61.89,24.19 61.34,23.65 49.82,23.65 48.85,24.63 25.41,24.63 22.28,27.76 21.9,27.76
  Top 1.27: SV31.16 21.88,27.74 21.9,27.76
VLED10
  Top 0.254: D10.A 104.49,20.22 103.51,19.24 97.84,19.24 97.27,19.81 86.17,19.81 85.16,18.81 79.6,18.81 79.03,19.38 67.97,19.38 66.99,18.4 61.04,18.4 60.48,18.96 50.06,18.96 48.81,17.72 27.66,17.72 25.09,15.15 21.91,15.15
  Top 1.27: SV31.6 21.8,15.04 21.91,15.15
VLED11
  Top 0.254: D11.A 122.73,22.43 121.77,23.38 117.34,23.38 116.84,22.88 104.61,22.88 103.68,23.81 98.91,23.81 98.36,23.27 86.31,23.27 85.33,24.25 80,24.25 79.43,23.68 68.13,23.68 67.2,24.6 61.72,24.6 61.18,24.06 49.99,24.06 49.02,25.03 26.34,25.03 22.14,29.23 19.04,29.23 18.64,29.63
  Top 1.27: SV31.17 18.64,29.69 18.64,29.63
VLED12
  Top 0.254: D12.A 122.75,20.22 121.77,19.24 117.27,19.24 116.73,19.79 104.63,19.79 103.68,18.83 97.67,18.83 97.1,19.41 86.34,19.41 85.33,18.4 79.43,18.4 78.86,18.97 68.14,18.97 67.16,17.99 60.87,17.99 60.31,18.56 50.22,18.56 48.98,17.31 28.4,17.31 25.03,13.94 19.36,13.94 18.85,13.43
  Top 1.27: SV31.3 18.85,13.29 18.85,13.43
VLED13
  Top 0.254: D13.A 141.33,22.4 140.32,23.41 135.88,23.41 135.31,22.84 122.89,22.84 121.94,23.79 117.17,23.79 116.68,23.29 104.78,23.29 103.85,24.22 98.73,24.22 98.18,23.67 86.48,23.67 85.5,24.65 79.83,24.65 79.26,24.08 68.3,24.08 67.37,25.01 61.55,25.01 61.01,24.46 50.16,24.46 49.18,25.44 27.09,25.44 22.24,30.28 21.81,30.28
  Top 1.27: SV31.18 21.81,30.28
VLED14
  Top 0.254: D14.A 141.27,20.19 140.32,19.24 135.88,19.24 135.31,19.81 122.92,19.81 121.94,18.83 117.11,18.83 116.56,19.38 104.8,19.38 103.85,18.43 97.5,18.43 96.93,19 86.5,19 85.5,17.99 79.27,17.99 78.69,18.57 68.31,18.57 67.33,17.59 60.7,17.59 60.14,18.15 50.39,18.15 49.15,16.91 29.24,16.91 24.93,12.6 21.8,12.6
  Top 1.27: SV31.4 21.7,12.5 21.8,12.6
VLED15
  Top 0.254: D15.A 159.61,22.4 158.63,23.38 154.2,23.38 153.62,22.8 141.49,22.8 140.48,23.81 135.72,23.81 135.15,23.24 123.06,23.24 122.11,24.19 117,24.19 116.51,23.7 104.95,23.7 104.02,24.63 98.56,24.63 98.02,24.08 86.65,24.08 85.67,25.06 79.66,25.06 79.09,24.49 68.47,24.49 67.54,25.41 61.38,25.41 60.84,24.87 50.33,24.87 49.35,25.85 27.99,25.85 22.17,31.66 19.53,31.66 19,32.19
  Top 1.27: SV31.19 18.38,32.82 19,32.19
VLED16
  Top 0.254: D16.A 159.58,20.17 158.63,19.21 154.2,19.21 153.62,19.79 141.44,19.79 140.48,18.83 135.72,18.83 135.14,19.41 123.09,19.41 122.11,18.43 116.94,18.43 116.39,18.97 104.97,18.97 104.02,18.02 97.34,18.02 96.76,18.59 86.67,18.59 85.67,17.59 79.1,17.59 78.52,18.16 68.48,18.16 67.5,17.18 60.53,17.18 59.97,17.74 50.56,17.74 49.31,16.5 30.29,16.5 25.01,11.22 19.27,11.22 18.9,10.86
  Top 1.27: SV31.1 18.9,10.81 18.9,10.86
VLED17
  Top 0.254: D17.A 178.21,22.37 177.2,23.38 172.76,23.38 172.19,22.81 159.78,22.81 158.8,23.79 154.03,23.79 153.45,23.21 141.66,23.21 140.65,24.22 135.55,24.22 134.98,23.65 123.23,23.65 122.28,24.6 116.84,24.6 116.34,24.1 105.11,24.1 104.18,25.03 98.39,25.03 97.85,24.49 86.81,24.49 85.84,25.46 79.49,25.46 78.92,24.89 68.63,24.89 67.71,25.82 61.21,25.82 60.67,25.28 50.5,25.28 49.52,26.25 28.44,26.25 21.88,32.82
  Top 0.305: D17.A 191.94,22.07
  Top 1.27: SV31.20 21.88,32.82
VLED18
  Top 0.254: D18.A 178.17,20.16 177.2,19.19 172.76,19.19 172.19,19.76 159.75,19.76 158.8,18.81 154.03,18.81 153.46,19.38 141.61,19.38 140.65,18.43 135.55,18.43 134.97,19 123.26,19 122.28,18.02 116.77,18.02 116.22,18.57 105.14,18.57 104.18,17.61 97.17,17.61 96.59,18.19 86.84,18.19 85.84,17.18 78.93,17.18 78.36,17.75 68.65,17.75 67.67,16.77 60.37,16.77 59.8,17.34 50.73,17.34 49.48,16.09 31.59,16.09 25.59,10.1 21.98,10.1
  Top 1.27: SV31.2 20.73,10.1 21.98,10.1

### Text on the board
tPlace: A8 | D17 | D18
bNames: JOSHUA BREWSTER (MIT LICENSE)
tValues: A1 | A2 | A3 | A4 | A5 | A6 | A7 | A9 | A10 | A11 | A12 | A13 | A14 | A8 | A15
tDocu: BASED ON pnas.org/content/104/29/12169 | 16 optical channels, 9 LED pairs / Forehead DIY-DOT | Use OPT101 (the cheap aliexpress ones) / and 1206 spec LEDs